# Altium schematic sheet poweramp.SchDoc
size A; SheetNumber: 2; SheetTotal: 2
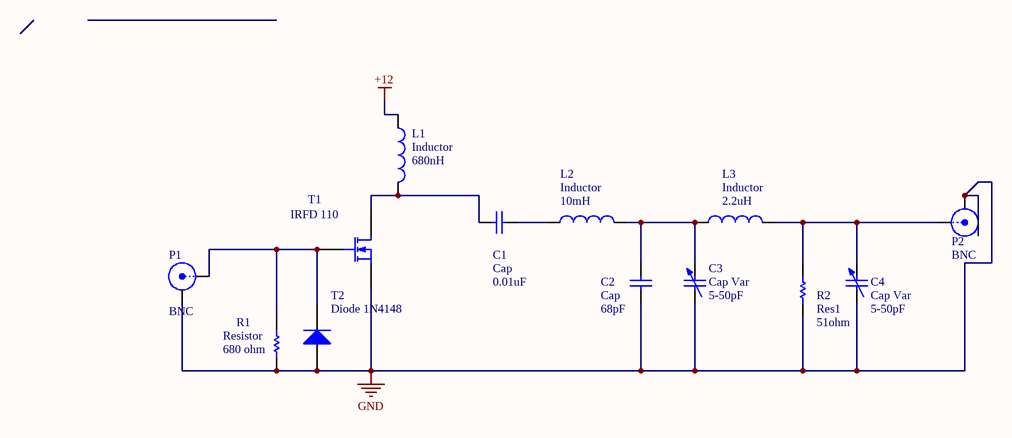
[diagram p0: poweramp.SchDoc]

## Parts
C1  Cap  value 0.01uF  [RAD-0.3]
C2  Cap  value 68pF  [RAD-0.3]
C3  Cap Var  value 5-50pF  [C1210_N]
C4  Cap Var  value 5-50pF  [C1210_N]
L1  Inductor  value 680nH  [0402-A]
L2  Inductor  value 10mH  [0402-A]
L3  Inductor  value 2.2uH  [0402-A]
P1  BNC  [BNC_RA CON]
P2  BNC  [BNC_RA CON]
R1  Resistor  value 680 ohm  [AXIAL-0.3]
R2  Res1  value 51ohm  [AXIAL-0.3]
T1  IRFD 110  [E3]
T2  Diode 1N4148  [DO-35]

## Nets
+12: L1.1
GND: C2.1 C3.1 C4.1 P1.2(Y) P2.2(Y) R1.2 R2.1 T1.3(S) T2.1(A)
NetC1_1: C1.1 L1.2 T1.1(D)
NetC1_2: C1.2 L2.1
NetC2_2: C2.2 C3.2 L2.2 L3.1
NetC4_2: C4.2 L3.2 P2.1(X) R2.2
NetP1_1: P1.1(X) R1.1 T1.2(G) T2.2(K)

## Library data of the parts
C1 C2 = Cap: Capacitor; Published: 8-Jun-2000; LatestRevisionDate: 17-Jul-2002; LatestRevisionNote: Re-released for DXP Platform.; PackageReference: RAD-0.3; Publisher: Altium Limited; PackageDescription: Radial Cap, Thru-Hole; 2 Leads; 0.3 in Pin Spacing
C3 C4 = Cap Var: Variable or Adjustable Capacitor; Published: 24-Mar-1999; LatestRevisionDate: 29-May-2009; LatestRevisionNote: IPC-7351 Footprint Added.; PackageReference: C1210; Publisher: Altium Limited; PackageDescription: Chip Capacitor 1210 Case Size; Code_JEITA: 1210; Code_IPC: CAPC3225
L1-L3 = Inductor: Code_IEC: 1005; Published: 8-Jun-2000; LatestRevisionDate: 29-May-2009; LatestRevisionNote: IPC-7351 Footprint Added.; PackageReference: 0402-A; Publisher: Altium Limited; PackageDescription: Chip Inductor; Code_JEITA: 0402
P1 P2 = BNC: BNC Elbow Connector; LatestRevisionDate: 17-Jul-2002; LatestRevisionNote: Re-released for DXP Platform.; Publisher: Altium Limited
R1 = Res1: Published: 8-Jun-2000; LatestRevisionDate: 17-Jul-2002; LatestRevisionNote: Re-released for DXP Platform.; PackageReference: AXIAL-0.3; Publisher: Altium Limited; PackageDescription: Axial Device, Thru-Hole; 2 Leads; 0.3 in Pin Spacing
R2 = Res1: Resistor; Published: 8-Jun-2000; LatestRevisionDate: 17-Jul-2002; LatestRevisionNote: Re-released for DXP Platform.; PackageReference: AXIAL-0.3; Publisher: Altium Limited; PackageDescription: Axial Device, Thru-Hole; 2 Leads; 0.3 in Pin Spacing
T1 = MOSFET-N: N-Channel MOSFET; Published: 8-Jun-2000; LatestRevisionDate: 17-Jul-2002; LatestRevisionNote: Re-released for DXP Platform.; PackageVersion: 1995/1996; PackageReference: E3; Publisher: Altium Limited; PackageDescription: TO, Flat Index; 3 In-Line, Axial Leads; Body Dia. 4.6mm; Lead Dia. 0.5 mm (max)
T2 = Diode 1N4148: High Conductance Fast Diode; Published: 8-Jun-2000; LatestRevisionDate: 17-Jul-2002; LatestRevisionNote: Re-released for DXP Platform.; DatasheetVersion: 1997; PackageReference: DO-35; Publisher: Altium Limited; PackageDescription: Diode, Axial; Body 3.8 x 1.9 mm (LxDia. max), Lead Dia. 0.53 mm (max); Code_JEDEC: DO-204-AH; ComponentLink1Description: Manufacturer Link; ComponentLink1URL: http://www.fairchildsemi.com/; ComponentLink2Description: Datasheet; ComponentLink2URL: http://www.fairchildsemi.com/ds/1N%2F1N4148.pdf